# Altium schematic sheet Pwr.SchDoc
size A4; Organization: ArSilicii s.r.l.; Address1: Via Sardegna, 11; Address2: 53036 Poggibonsi (SI)  - ITALY -; Address3: e-mail : ArSilicii@ArSilicii.com; SheetNumber: 0; SheetTotal: 0
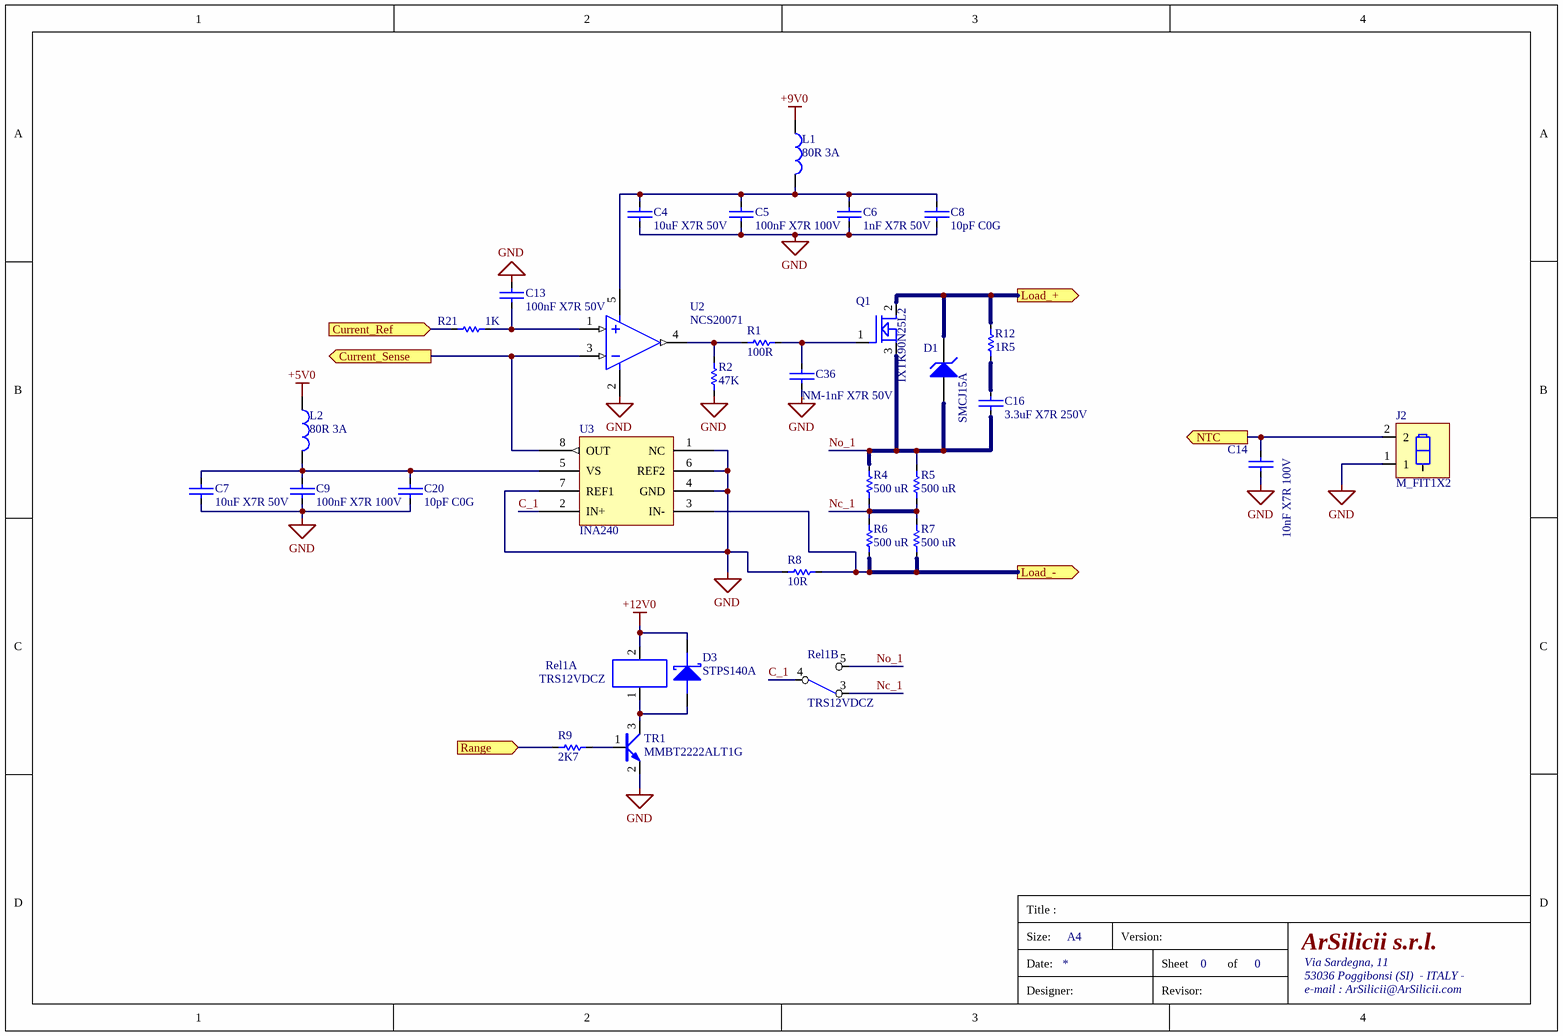
[diagram p0: Pwr.SchDoc]

## Parts
C4  10uF X7R 50V  [1206]
C5  100nF X7R 100V  [0805]
C6  1nF X7R 50V  [0603]
C7  10uF X7R 50V  [1206]
C8  10pF C0G  [0805]
C9  100nF X7R 100V  [0805]
C13  100nF X7R 50V  [0603]
C14  10nF X7R 100V  [0805]
C16  3.3uF X7R 250V  [2220]
C20  10pF C0G  [0805]
C36  NM-1nF X7R 50V  [0603]
D1  SMCJ15A  [LFUS-DO-214AB-2_V]
D3  STPS140A  [SMA]
J2  M_FIT1X2  [M_FIT_JR1X2V]
L1  80R 3A  [1206]
L2  80R 3A  [1206]
Q1  IXTK90N25L2  [PLUS-247]
R1  100R  [0805]
R2  47K  [0805]
R4  500 uR  [2512]
R5  500 uR  [2512]
R6  500 uR  [2512]
R7  500 uR  [2512]
R8  10R  [1206]
R9  2K7  [0805]
R12  1R5  [2512]
R21  1K  [0805]
Rel1  TRS12VDCZ  [RELE_TRS]  (parts A,B of 2)
TR1  MMBT2222ALT1G  [SOT-23]
U2  NCS20071  [SOT-553-5]
U3  INA240  [TSSOP-8]

## Ports
Current_Ref (in), Current_Sense (out), Load_+ (out), Load_- (out), NTC (out), Range (in)

## Nets
+5V0: L2.1
+9V0: L1.1
+12V0: D3.K Rel1.2
GND: C4.2 C5.2 C6.2 C7.2 C8.2 C9.2 C13.2 C14.2 C20.2 C36.1 J2.1 R2.2 R8.2 TR1.2(E) U2.2 U3.1(NC) U3.4(GND) U3.6(REF2) U3.7(REF1)
C_1: Rel1.4 U3.2(IN+)
Current_Ref: R21.1 ; port Current_Ref
Current_Sense: U2.3 U3.8(OUT) ; port Current_Sense
Load_+: D1.2(K) Q1.2(DRAIN) R12.1 ; port Load_+
Load_-: R6.2 R7.2 R8.1 U3.3(IN-) ; port Load_-
Nc_1: R4.2 R5.2 R6.1 R7.1 Rel1.3
No_1: C16.2 D1.1(A) Q1.3(SOURCE) R4.1 R5.1 Rel1.5
NTC: C14.1 J2.2 ; port NTC
Range: R9.2 ; port Range
NetC4_1: C4.1 C5.1 C6.1 C8.1 L1.2 U2.5
NetC7_1: C7.1 C9.1 C20.1 L2.2 U3.5(VS)
NetC13_1: C13.1 R21.2 U2.1
NetC16_1: C16.1 R12.2
NetC36_2: C36.2 Q1.1(GATE) R1.2
NetD3_A: D3.A Rel1.1 TR1.3(C)
NetR1_1: R1.1 R2.1 U2.4
NetR9_1: R9.1 TR1.1(B)

## Notes on the sheet
- Title :
- Size:
- Date:
- A4
- Version:
- Sheet
- of
- Designer:
- Revisor:

## Library data of the parts
C4 C7 = CAP_10uF X7R 50V_1206: Capacità; ArSilicii Part Number: CPC0232011; Manufacturer Part Number: CL31B106KBHNNNE; SMD/TH: SMD; 1 Supplier: ARROW ELECTRONICS ITALIA S.R.L.; 1 Supplier Part Number: CL31B106KBHNNNE; 1 Supplier Unit Price: *; 2 Supplier: *; 2 Supplier Part Number: *; 2 Supplier Unit Price: *; 3 Supplier: *; 3 Supplier Part Number: *; 3 Supplier Unit Price: *; Manufacturer: *; ComponentLink1URL: *; ComponentLink2URL: *; ComponentLink1Description: Datasheet for 10uF X7R 25V; ComponentLink2Description: *; HelpURL: *
C5 C9 C14 = CAP_100nF X7R 100V_0805: Capacità; ArSilicii Part Number: CPC0213101; Manufacturer: SAMSUNG; Manufacturer Part Number: CL21B104KCFSFNG; SMD/TH: SMD; 1 Supplier: ARROW ELECTRONICS ITALIA S.R.L.; 1 Supplier Part Number: CL21B104KCFSFNG; 1 Supplier Unit Price: *; 2 Supplier: FARNELL ITALIA S.R.L.; 2 Supplier Part Number: 1907331; 2 Supplier Unit Price: *; 3 Supplier: *; 3 Supplier Part Number: *; 3 Supplier Unit Price: *; ComponentLink1URL: *; ComponentLink2URL: *; ComponentLink1Description: *; ComponentLink2Description: *; HelpURL: *
C6 C13 C36 = CAP_1nF X7R 50V_0603: Capacità; ArSilicii Part Number: CPC0263001; Manufacturer: KEMET; Manufacturer Part Number: C0603C102K5RACTU; SMD/TH: SMD; 1 Supplier: ARROW ELECTRONICS ITALIA S.R.L.; 1 Supplier Part Number: CC0603JRX7R9BB102; 1 Supplier Unit Price: *; 2 Supplier: *; 2 Supplier Part Number: *; 2 Supplier Unit Price: *; 3 Supplier: *; 3 Supplier Part Number: *; 3 Supplier Unit Price: *; ComponentLink1URL: *; ComponentLink2URL: *; ComponentLink1Description: *; ComponentLink2Description: *; HelpURL: *
C8 C20 = CAP_10pF C0G_0805: Capacità; ArSilicii Part Number: CPC0614010; SMD/TH: SMD; 1 Supplier: *; 1 Supplier Part Number: *; 1 Supplier Unit Price: 0,09; 2 Supplier: *; 2 Supplier Part Number: *; 2 Supplier Unit Price: *; 3 Supplier: *; 3 Supplier Part Number: *; 3 Supplier Unit Price: *; Manufacturer: *; Manufacturer Part Number: *; ComponentLink1URL: *; ComponentLink2URL: *; ComponentLink1Description: *; ComponentLink2Description: *; HelpURL: *
C16 = CAP_1uF X7R 250V_2220: Capacità; Manufacturer: TDK; Manufacturer Part Number: CGA9N3X7R2E105K230KA; SMD/TH: SMD; 1 Supplier: FARNELL ITALIA S.R.L.; 1 Supplier Part Number: 2435506; 1 Supplier Unit Price: 0,606; 2 Supplier: MOUSER; 2 Supplier Part Number: 810-CGA9N3X7R2E105K; 2 Supplier Unit Price: 0,594; 3 Supplier: *; 3 Supplier Part Number: *; 3 Supplier Unit Price: *; ArSilicii Part Number: *; ComponentLink1URL: *; ComponentLink2URL: *; ComponentLink1Description: *; ComponentLink2Description: *; HelpURL: *
D1 = CMP-2000-07102-1: Transient Voltage Suppression Diode, 15 V, -65 to 150 degC, 2-Pin DO-214AB (SMCJ), RoHS, Tape and Reel; Manufacturer: Littelfuse; Directional: Uni-Directional; Power Dissipation: 1500W; Clamping Voltage-Max: 24.4V; Breakdown Voltage-Min: 16.7V; Breakdown Voltage-Max: 18.5V; Mounting Technology: SurfaceMount; Package Reference: DO-214AB; Manufacturer URL: http://www.littelfuse.com/; Package Description: 2-Pin Surface Mount Device, Body 6.855 x 5.905 mm; Datasheet URL: http://www.littelfuse.com/products/tvs-diodes/surface-mount/~/media/electronics/datasheets/tvs_diodes/littelfuse_tvs_diode_smcj_datasheet.pdf.pdf; Datasheet Version: 11/2015
D3 = DIODE SCHOTTKY_STPS140A: Diodo Schottky; Manufacturer: STMicroelectronics; ArSilicii Part Number: CPDS117000; SMD/TH: SMD; Manufacturer Part Number: STPS140A; 1 Supplier Part Number: STMSTPS140A; 2 Supplier: *; 2 Supplier Part Number: *; 2 Supplier Unit Price: *; 3 Supplier Part Number: *; 1 Supplier: ARROW ELECTRONICS ITALIA S.R.L.; 1 Supplier Unit Price: 0,0600; 3 Supplier: *; 3 Supplier Unit Price: *; ComponentLink1URL: http://www.st.com/web/en/resource/technical/document/datasheet/CD00001107.pdf; ComponentLink2URL: *; ComponentLink1Description: Datasheet for STPS140A; ComponentLink2Description: *; HelpURL: *
J2 = M_FIT1X2: Mini Fit Junior 2 poli; ArSilicii Part Number: QA02006000; Manufacturer: Molex; SMD/TH: TH; 1 Supplier: ABACUS ECC S.R.L. - UNIPERSONALE; 1 Supplier Part Number: *; 1 Supplier Unit Price: 0,07900; 2 Supplier: HT COMPONENTI ELETTRONICI S.R.L.; 2 Supplier Part Number: *; 2 Supplier Unit Price: *; 3 Supplier: *; 3 Supplier Part Number: *; 3 Supplier Unit Price: *; Manufacturer Part Number: 39-28-1023; ComponentLink1URL: http://www.molex.com/webdocs/datasheets/pdf/en-us/0039281023_PCB_HEADERS.pdf; ComponentLink2URL: *; ComponentLink1Description: Datasheet for M_FIT1X2; ComponentLink2Description: *; HelpURL: *
L1 L2 = Ferrite 80R 3A: Ferrite; ArSilicii Part Number: CPF0006000; Manufacturer: Wurth Elektronik; Manufacturer Part Number: 74279215; SMD/TH: SMD; 1 Supplier: RS COMPONENTS S.P.A.; 1 Supplier Part Number: 3275550P; 1 Supplier Unit Price: 0,21000; 2 Supplier: *; 2 Supplier Part Number: *; 2 Supplier Unit Price: *; 3 Supplier: *; 3 Supplier Part Number: *; 3 Supplier Unit Price: *; ComponentLink1URL: http://docs-europe.electrocomponents.com/webdocs/0033/0900766b80033a26.pdf; ComponentLink2URL: *; ComponentLink1Description: Datasheet for Ferrite 80R 3A; ComponentLink2Description: *; HelpURL: *; Supplier 1: Digi-Key; Supplier Part Number 1: 732-1629-1-ND
Q1 = IXTK90N25L2: MOS CANALE N-250V-90A Linear; ArSilicii Part Number: CPTP200080; Manufacturer Part Number: IPB90N06S404ATMA2; SMD/TH: SMD; 1 Supplier: EBV ELEKTRONIK S.R.L.; 1 Supplier Part Number: PB90N06S4-04; 1 Supplier Unit Price: 0,56; 2 Supplier: RS COMPONENTS S.R.L.; 2 Supplier Part Number: 826-9042P; 2 Supplier Unit Price: *; 3 Supplier: *; 3 Supplier Part Number: *; 3 Supplier Unit Price: *; Manufacturer: *; ComponentLink1URL: *; ComponentLink2URL: *; ComponentLink1Description: *; ComponentLink2Description: *; HelpURL: *
R1 R2 R4-R9 R12 R21 = RES_SMD: Resistenza; SMD/TH: SMD; 1 Supplier: *; 1 Supplier Part Number: *; 1 Supplier Unit Price: *; 2 Supplier: *; 2 Supplier Part Number: *; 2 Supplier Unit Price: *; 3 Supplier: *; 3 Supplier Part Number: *; 3 Supplier Unit Price: *; ArSilicii Part Number: *; Manufacturer: *; Manufacturer Part Number: *; ComponentLink1URL: *; ComponentLink2URL: *; ComponentLink1Description: *; ComponentLink2Description: *; HelpURL: *
Rel1 = RELE'_TRS12VDCZ: Relay; ArSilicii Part Number: CR00015100; Manufacturer: Tianbo; SMD/TH: TH; 1 Supplier: DISTAR S.R.L.; 1 Supplier Part Number: TRS12VDCZ; 1 Supplier Unit Price: 0,337; 2 Supplier: STEALTH COMPONENTS, INC.; 2 Supplier Part Number: FRS3M C-S DC12V; 2 Supplier Unit Price: *; 3 Supplier: FITRE S.P.A.; 3 Supplier Part Number: R504D/012Z1F; 3 Supplier Unit Price: *; Manufacturer Part Number: TRS12VDCZ; ComponentLink1URL: http://www.spbnek.ru/mycontent/firm/tianbo/trs.pdf; ComponentLink2URL: *; ComponentLink1Description: Datasheet for TRS12VDCZ; ComponentLink2Description: *; HelpURL: *
TR1 = NPN_MMBT2222ALT1G: NPN Transistor; ArSilicii Part Number: CPTS001000; Manufacturer: ON SEMICONDUCTOR; SMD/TH: SMD; Supplier 1: Farnell; Supplier Part Number 1: 1459098; 1 Supplier: ARROW ELECTRONICS ITALIA S.R.L.; 1 Supplier Part Number: SCGMMBT2222ALT1G; 1 Supplier Unit Price: 0,00777; 2 Supplier: Farnell; 2 Supplier Part Number: 1459098; 2 Supplier Unit Price: 0,085; 3 Supplier: *; 3 Supplier Part Number: *; 3 Supplier Unit Price: *; Manufacturer Part Number: MMBT2222ALT1G; ComponentLink1URL: http://www.onsemi.com/pub_link/Collateral/MMBT2222LT1-D.PDF; ComponentLink2URL: *; ComponentLink1Description: Datasheet for MMBT2222ALT1G; ComponentLink2Description: *; HelpURL: D:\Documenti ArSilicii\DataSheet\Transistor\MMBT2222LT1-D.pdf
U2 = NCS20071: Rail-to-Rail Input/Output, 3 MHz Op Amps; Manufacturer: Microchip Technology; Manufacturer Part Number: MCP6021-E/SN; SMD/TH: SMD; 1 Supplier: DigiKey; 1 Supplier Part Number: MCP6021-E/SN-ND; 1 Supplier Unit Price: 1,22; 2 Supplier: *; 2 Supplier Part Number: *; 2 Supplier Unit Price: *; 3 Supplier: *; 3 Supplier Part Number: *; 3 Supplier Unit Price: *; ArSilicii Part Number: *; ComponentLink1URL: http://ww1.microchip.com/downloads/en/DeviceDoc/21685d.pdf; ComponentLink2URL: *; ComponentLink1Description: Datasheet for MCP6021; ComponentLink2Description: *; HelpURL: *
U3 = INA240: Current sense amplifier; SMD/TH: SMD; 2 Supplier Unit Price: *; 3 Supplier: *; 3 Supplier Part Number: *; 3 Supplier Unit Price: *; ComponentLink2URL: *; ComponentLink2Description: *